# EAGLE design pro-one-oscillators-with-connectors-and-ground-plane (EAGLE 5.07)
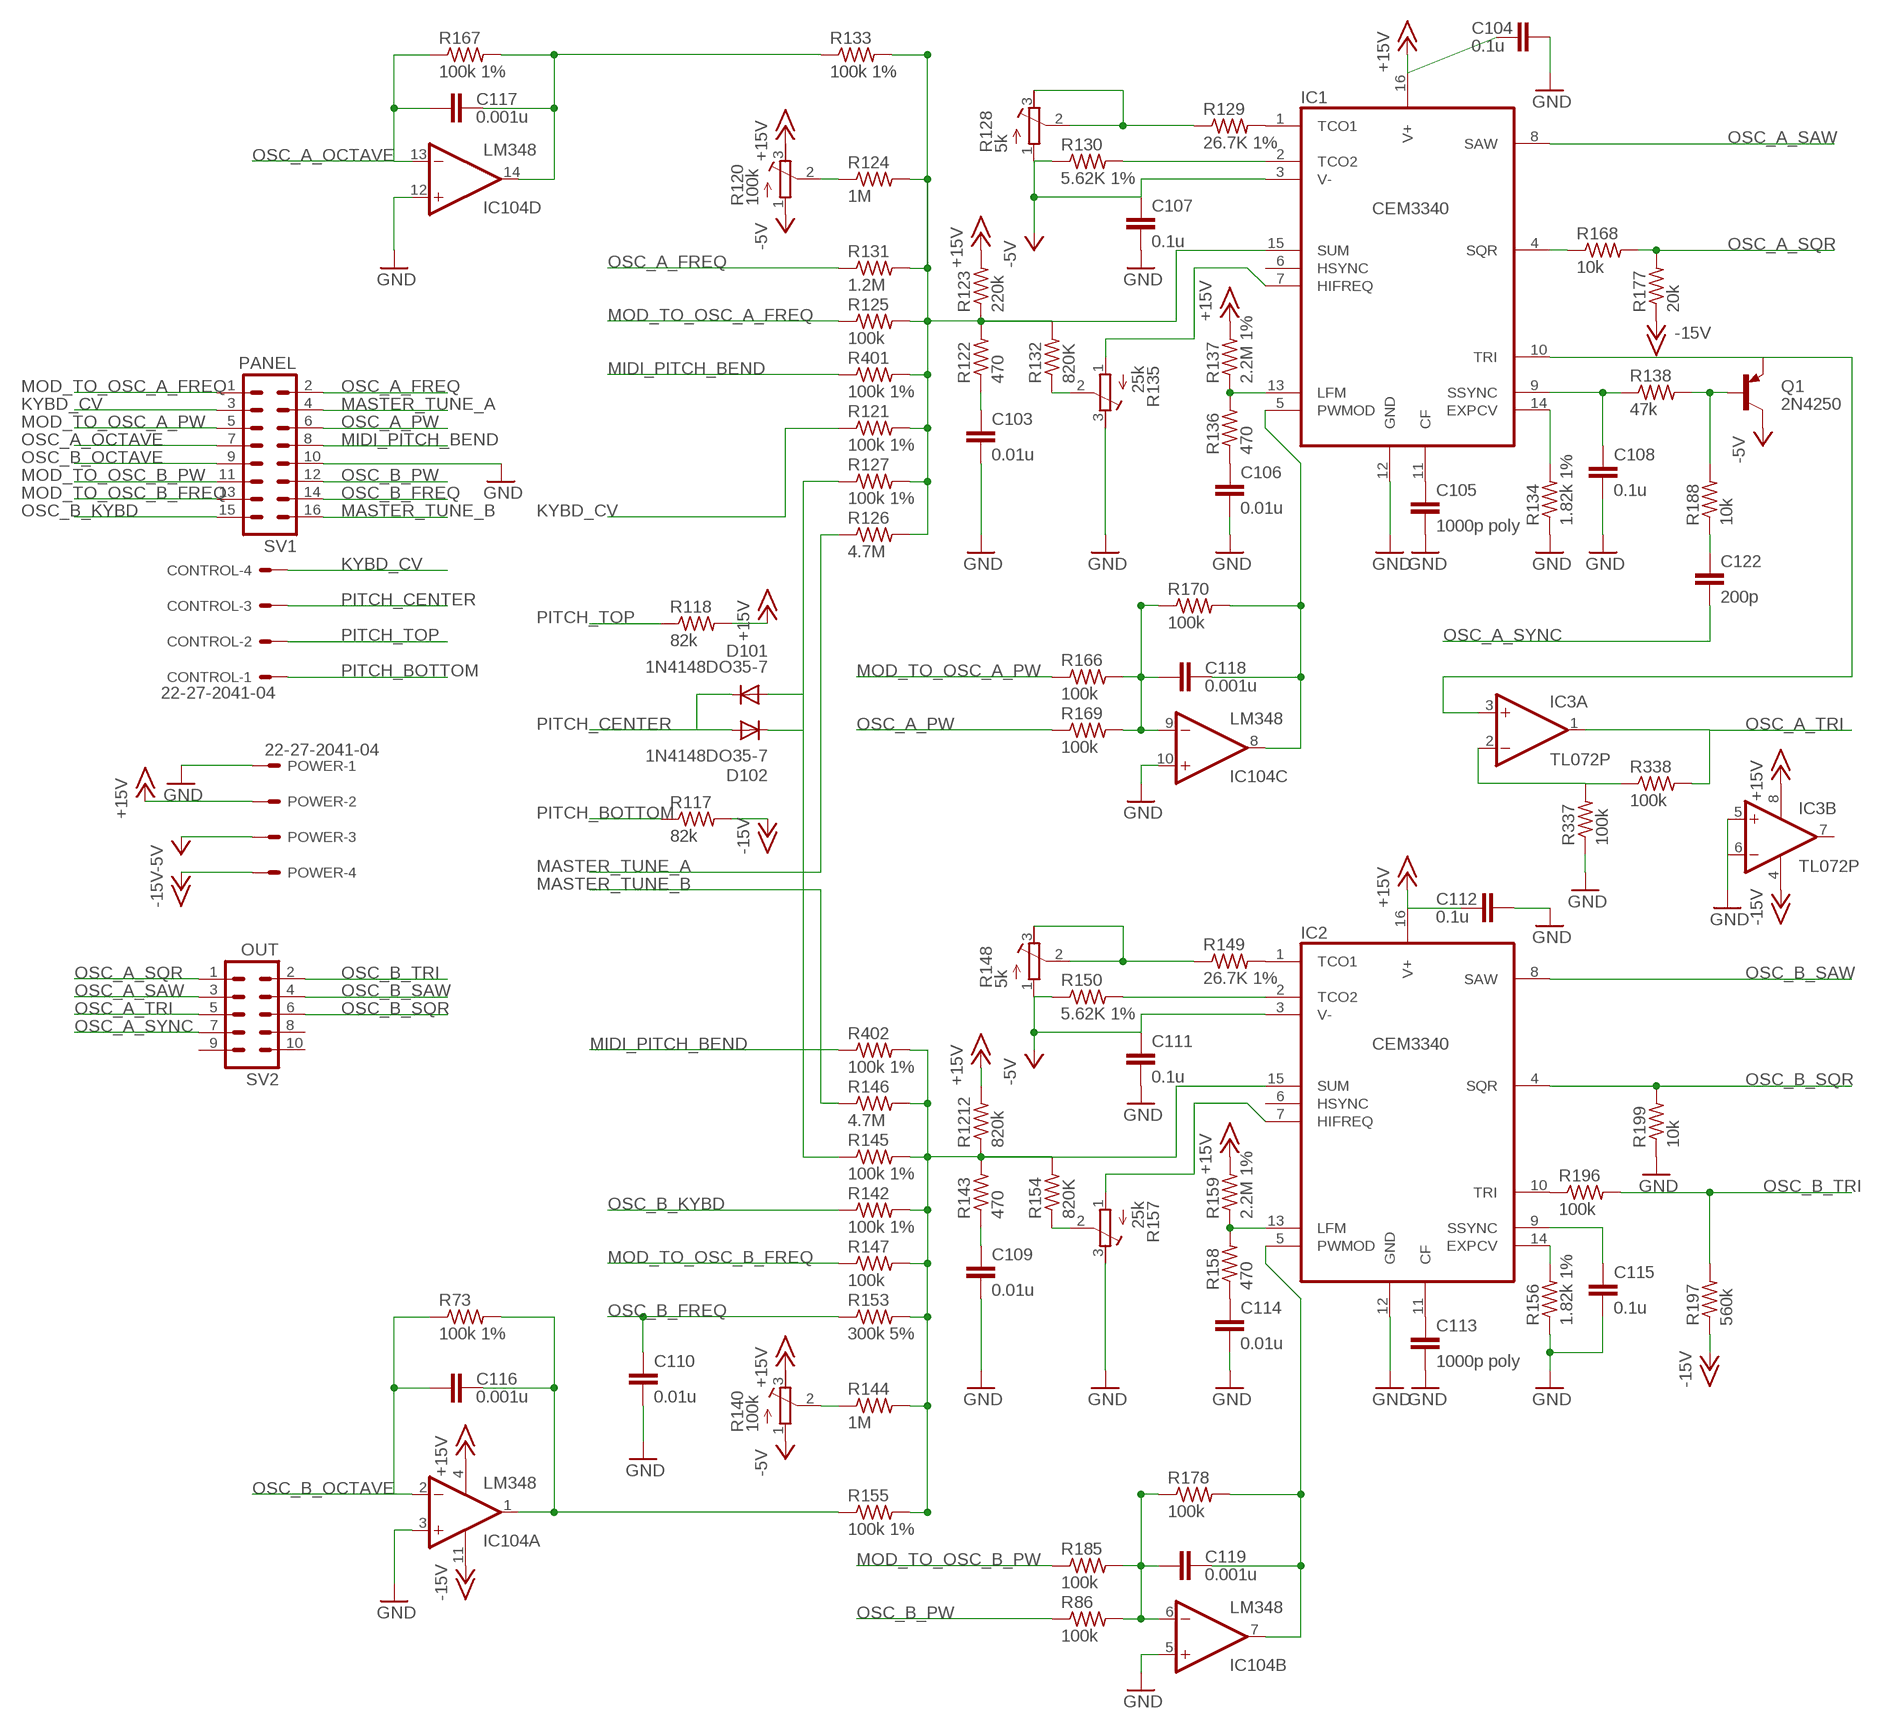
[diagram p0: schematic, sheet 1]

## Parts
C103  0.01u  C-EU050-025X075  [C050-025X075]
C104  0.1u  C-EU050-025X075  [C050-025X075]
C105  1000p poly  C-EU050-025X075  [C050-025X075]
C106  0.01u  C-EU050-025X075  [C050-025X075]
C107  0.1u  C-EU050-025X075  [C050-025X075]
C108  0.1u  C-EU050-025X075  [C050-025X075]
C109  0.01u  C-EU050-025X075  [C050-025X075]
C110  0.01u  C-EU050-025X075  [C050-025X075]
C111  0.1u  C-EU050-025X075  [C050-025X075]
C112  0.1u  C-EU050-025X075  [C050-025X075]
C113  1000p poly  C-EU050-025X075  [C050-025X075]
C114  0.01u  C-EU050-025X075  [C050-025X075]
C115  0.1u  C-EU050-025X075  [C050-025X075]
C116  0.001u  C-EU050-025X075  [C050-025X075]
C117  0.001u  C-EU050-025X075  [C050-025X075]
C118  0.001u  C-EU050-025X075  [C050-025X075]
C119  0.001u  C-EU050-025X075  [C050-025X075]
C122  200p  C-EU050-025X075  [C050-025X075]
CONTROL  22-27-2041-04  [6410-04]
D101  1N4148DO35-7  [DO35-7]
D102  1N4148DO35-7  [DO35-7]
IC1  CEM3340  [DIL16]
IC2  CEM3340  [DIL16]
IC3  TL072P  [DIL08]
IC104  LM348  [DIL14]
POWER  22-27-2041-04  [6410-04]
Q1  2N4250  [TO92]
R73  100k 1%  R-US_0309/10  [0309/10]
R86  100k  R-US_0309/10  [0309/10]
R117  82k  R-US_0309/10  [0309/10]
R118  82k  R-US_0309/10  [0309/10]
R120  100k  R-TRIMM64W  [RTRIM64W]
R121  100k 1%  R-US_0309/10  [0309/10]
R122  470  R-US_0309/10  [0309/10]
R123  220k  R-US_0309/10  [0309/10]
R124  1M  R-US_0309/10  [0309/10]
R125  100k  R-US_0309/10  [0309/10]
R126  4.7M  R-US_0309/10  [0309/10]
R127  100k 1%  R-US_0309/10  [0309/10]
R128  5k  R-TRIMM64W  [RTRIM64W]
R129  26.7K 1%  R-US_0309/10  [0309/10]
R130  5.62K 1%  R-US_0309/10  [0309/10]
R131  1.2M  R-US_0309/10  [0309/10]
R132  820K  R-US_0309/10  [0309/10]
R133  100k 1%  R-US_0309/10  [0309/10]
R134  1.82k 1%  R-US_0309/10  [0309/10]
R135  25k  R-TRIMM64W  [RTRIM64W]
R136  470  R-US_0309/10  [0309/10]
R137  2.2M 1%  R-US_0309/10  [0309/10]
R138  47k  R-US_0309/10  [0309/10]
R140  100k  R-TRIMM64W  [RTRIM64W]
R142  100k 1%  R-US_0309/10  [0309/10]
R143  470  R-US_0309/10  [0309/10]
R144  1M  R-US_0309/10  [0309/10]
R145  100k 1%  R-US_0309/10  [0309/10]
R146  4.7M  R-US_0309/10  [0309/10]
R147  100k  R-US_0309/10  [0309/10]
R148  5k  R-TRIMM64W  [RTRIM64W]
R149  26.7K 1%  R-US_0309/10  [0309/10]
R150  5.62K 1%  R-US_0309/10  [0309/10]
R153  300k 5%  R-US_0309/10  [0309/10]
R154  820K  R-US_0309/10  [0309/10]
R155  100k 1%  R-US_0309/10  [0309/10]
R156  1.82k 1%  R-US_0309/10  [0309/10]
R157  25k  R-TRIMM64W  [RTRIM64W]
R158  470  R-US_0309/10  [0309/10]
R159  2.2M 1%  R-US_0309/10  [0309/10]
R166  100k  R-US_0309/10  [0309/10]
R167  100k 1%  R-US_0309/10  [0309/10]
R168  10k  R-US_0309/10  [0309/10]
R169  100k  R-US_0309/10  [0309/10]
R170  100k  R-US_0309/10  [0309/10]
R177  20k  R-US_0309/10  [0309/10]
R178  100k  R-US_0309/10  [0309/10]
R185  100k  R-US_0309/10  [0309/10]
R188  10k  R-US_0309/10  [0309/10]
R196  100k  R-US_0309/10  [0309/10]
R197  560k  R-US_0309/10  [0309/10]
R199  10k  R-US_0309/10  [0309/10]
R337  100k  R-US_0309/10  [0309/10]
R338  100k  R-US_0309/10  [0309/10]
R401  100k 1%  R-US_0309/10  [0309/10]
R402  100k 1%  R-US_0309/10  [0309/10]
R1212  820k  R-US_0309/10  [0309/10]
SV1  PANEL  MA08-2  [MA08-2]
SV2  OUT  MA05-2  [MA05-2]

## Nets
+15V: C104.1 C112.1 IC1.16(V+) IC2.16(V+) IC3.8(P:V+) IC104.4(P:V+) POWER.2 R118.2 R120.3(A) R123.2 R137.2 R140.3(A) R159.2 R1212.2
-5V: C107.1 C111.1 IC1.3(V-) IC2.3(V-) POWER.3 Q1.1(C) R120.1(E) R128.1(E) R130.1 R140.1(E) R148.1(E) R150.1
-15V: IC3.4(P:V-) IC104.11(P:V-) POWER.4 R117.2 R177.1 R197.1
GND: C103.2 C104.2 C105.2 C106.2 C107.2 C108.2 C109.2 C110.2 C111.2 C112.2 C113.2 C114.2 C115.2 IC1.12(GND) IC2.12(GND) IC3.5(B:+IN) IC3.6(B:-IN) IC104.3(A:+IN) IC104.5(B:+IN) IC104.10(C:+IN) IC104.12(D:+IN) POWER.1 R134.1 R135.3(A) R156.1 R157.3(A) R199.1 R337.1 SV1.10
KYBD_CV: CONTROL.4 R121.1 SV1.3
MASTER_TUNE_A: R126.1 SV1.4
MASTER_TUNE_B: R146.1 SV1.16
MIDI_PITCH_BEND: R401.1 R402.1 SV1.8
MOD_TO_OSC_A_FREQ: R125.1 SV1.1
MOD_TO_OSC_A_PW: R166.1 SV1.5
MOD_TO_OSC_B_FREQ: R147.1 SV1.13
MOD_TO_OSC_B_PW: R185.1 SV1.11
N$1: IC1.1(TCO1) R129.2
N$2: IC1.2(TCO2) R130.2
N$3: IC1.13(LFM) R136.2 R137.1
N$4: IC1.15(SUM) R121.2 R122.2 R123.1 R124.2 R125.2 R126.2 R127.2 R131.2 R132.2 R133.2 R401.2
N$5: R128.2(S) R128.3(A) R129.1
N$6: C106.1 R136.1
N$7: C108.1 IC1.9(SSYNC) R138.1
N$8: IC1.7(HIFREQ) R135.1(E)
N$9: R132.1 R135.2(S)
N$10: C103.1 R122.1
N$11: C105.1 IC1.11(CF)
N$12: IC1.14(EXPCV) R134.2
N$13: IC1.4(SQR) R168.1
N$15: IC2.1(TCO1) R149.2
N$16: IC2.2(TCO2) R150.2
N$17: IC2.13(LFM) R158.2 R159.1
N$19: R148.2(S) R148.3(A) R149.1
N$20: IC2.7(HIFREQ) R157.1(E)
N$21: R154.1 R157.2(S)
N$22: C114.1 R158.1
N$23: C109.1 R143.1
N$24: IC2.14(EXPCV) R156.2
N$27: C115.1 IC2.9(SSYNC)
N$28: C113.1 IC2.11(CF)
N$30: R140.2(S) R144.1
N$31: D101.A D102.C R127.1 R145.1
N$34: C118.2 IC1.5(PWMOD) IC104.8(C:OUT) R170.2
N$36: C118.1 IC104.9(C:-IN) R166.2 R169.2 R170.1
N$38: C119.1 IC104.6(B:-IN) R86.2 R178.1 R185.2
N$39: C119.2 IC2.5(PWMOD) IC104.7(B:OUT) R178.2
N$40: C116.2 IC104.1(A:OUT) R73.2 R155.1
N$41: IC2.15(SUM) R142.2 R143.2 R144.2 R145.2 R146.2 R147.2 R153.2 R154.2 R155.2 R402.2 R1212.1
N$43: R120.2(S) R124.1
N$44: IC3.2(A:-IN) R337.2 R338.1
N$46: C117.2 IC104.14(D:OUT) R133.1 R167.2
N$52: Q1.2(B) R138.2 R188.2
N$54: IC1.10(TRI) IC3.3(A:+IN) Q1.3(E)
N$61: C122.1 R188.1
N$64: IC2.10(TRI) R196.1
OSC_A_FREQ: R131.1 SV1.2
OSC_A_OCTAVE: C117.1 IC104.13(D:-IN) R167.1 SV1.7
OSC_A_PW: R169.1 SV1.6
OSC_A_SAW: IC1.8(SAW) SV2.3
OSC_A_SQR: R168.2 R177.2 SV2.1
OSC_A_SYNC: C122.2 SV2.7
OSC_A_TRI: IC3.1(A:OUT) R338.2 SV2.5
OSC_B_FREQ: C110.1 R153.1 SV1.14
OSC_B_KYBD: R142.1 SV1.15
OSC_B_OCTAVE: C116.1 IC104.2(A:-IN) R73.1 SV1.9
OSC_B_PW: R86.1 SV1.12
OSC_B_SAW: IC2.8(SAW) SV2.4
OSC_B_SQR: IC2.4(SQR) R199.2 SV2.6
OSC_B_TRI: R196.2 R197.2 SV2.2
PITCH_BOTTOM: CONTROL.1 R117.1
PITCH_CENTER: CONTROL.3 D101.C D102.A
PITCH_TOP: CONTROL.2 R118.1
Unconnected: IC1.6(HSYNC) IC2.6(HSYNC) IC3.7(B:OUT) SV2.8 SV2.9 SV2.10

## Library data of the parts
C103-C119 C122 = resistor:C-EU: CAPACITOR, European symbol
CONTROL POWER = con-molex:22-?-04: CONNECTOR wire to board 2.54 mm (.1 inch) pitch header
D101 D102 = diode:1N4148: DIODE high speed (Philips)
IC1 IC2 = joakim:CEM3340: Voltage Controlled Oscillator for musical synthesizers
IC3 = linear:TL072: OP AMP
IC104 = joakim:LM348: Quad General Purpose, Low Voltage, Operational Amplifiers
Q1 = joakim:2N4250: PNP Transistor
R73 R86 R117 R118 R121-R127 R129-R134 R136-R138 R142-R147 R149 R150 R153-R156 R158 R159 R166-R170 R177 R178 R185 R188 R196 R197 R199 R337 R338 R401 R402 R1212 = resistor:R-US_: RESISTOR, American symbol
R120 R128 R135 R140 R148 R157 = resistor:R-TRIMM: Trimm resistor
SV1 = con-lstb:MA08-2: PIN HEADER
SV2 = con-lstb:MA05-2: PIN HEADER

## Board
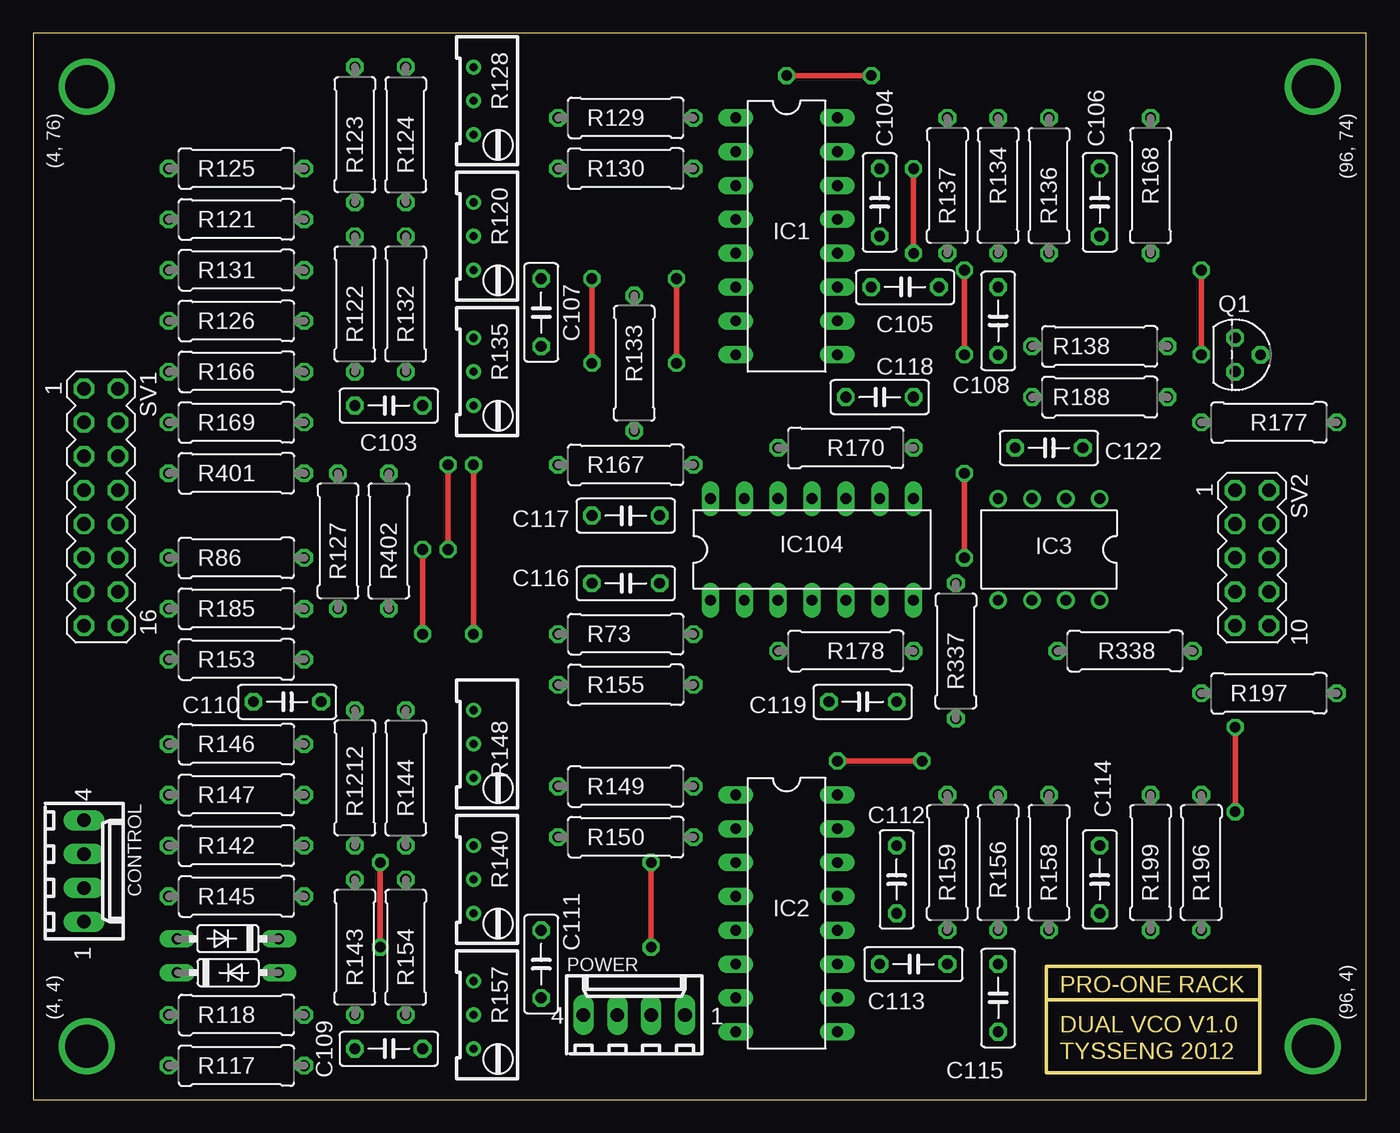
[diagram p1: board, top side]
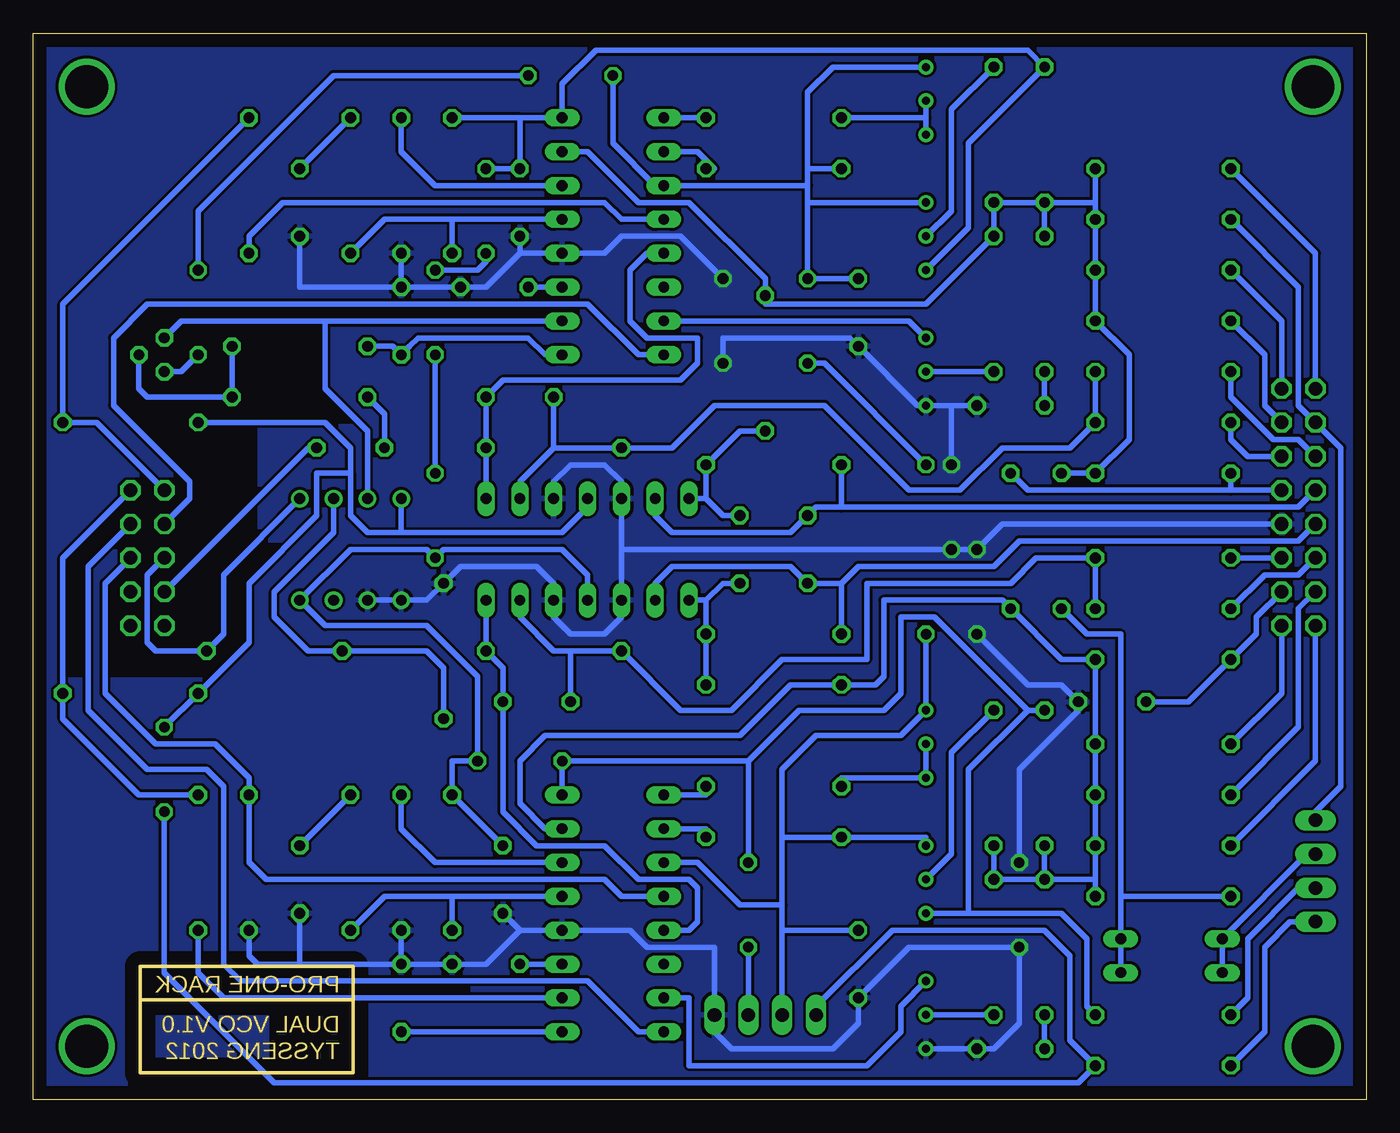
[diagram p2: board, bottom side, seen from below]

Size 100 x 80 mm. Coordinates in mm from the lower left corner, seen from the top.
Outline: 76,7.5 76,10 92,10 92,7.5
Outline: 76,7.5 76,2 92,2 92,7.5
Outline: 92,7.5 76,7.5
Outline: 0,0 100,0 100,80 0,80 0,0
Copper layers (1*16): Top 0.035mm / dielectric 1.5mm / Bottom 0.035mm
Design rules "default": minimum track width 10mil, minimum drill 24mil, track to track 8mil, track to pad 8mil, pad to pad 8mil, via to via 8mil, smd to smd 8mil, copper to edge 40mil, drill to drill 8mil, minimum pad ring 10mil, minimum via ring 8mil, stop-mask expansion 4mil, vias tented up to drill 0mil, thermal gap 10mil

### Footprints (pad centres in the part's own frame; a part is rotated, then mirrored left to right if it is on the bottom)
C050-025X075 = drill 0.813 octagon: 1 -2.54,0; 2 2.54,0
6410-04 = drill 1.016 long: 1 3.81,0; 2 1.27,0; 3 -1.27,0; 4 -3.81,0
DO35-7 = drill 0.813 long: A 3.81,0; C -3.81,0
DIL16 = drill 0.813 long: 1 -8.89,-3.81; 2 -6.35,-3.81; 3 -3.81,-3.81; 4 -1.27,-3.81; 5 1.27,-3.81; 6 3.81,-3.81; 7 6.35,-3.81; 8 8.89,-3.81; 9 8.89,3.81; 10 6.35,3.81; 11 3.81,3.81; 12 1.27,3.81; 13 -1.27,3.81; 14 -3.81,3.81; 15 -6.35,3.81; 16 -8.89,3.81
DIL08 = drill 0.813 pad 1.27 round: 1 -3.81,-3.81; 2 -1.27,-3.81; 3 1.27,-3.81; 4 3.81,-3.81; 5 3.81,3.81; 6 1.27,3.81; 7 -1.27,3.81; 8 -3.81,3.81
DIL14 = drill 0.813 long: 1 -7.62,-3.81; 2 -5.08,-3.81; 3 -2.54,-3.81; 4 0,-3.81; 5 2.54,-3.81; 6 5.08,-3.81; 7 7.62,-3.81; 8 7.62,3.81; 9 5.08,3.81; 10 2.54,3.81; 11 0,3.81; 12 -2.54,3.81; 13 -5.08,3.81; 14 -7.62,3.81
TO92 = drill 0.813 octagon: 1 1.27,0; 2 0,1.905; 3 -1.27,0
0309/10 = drill 0.813 octagon: 1 -5.08,0; 2 5.08,0
RTRIM64W = drill 0.61 round: 1 1.27,-2.54; 2 1.27,0; 3 1.27,2.54
MA08-2 = drill 1.016 octagon: 1 -8.89,-1.27; 2 -8.89,1.27; 3 -6.35,-1.27; 4 -6.35,1.27; 5 -3.81,-1.27; 6 -3.81,1.27; 7 -1.27,-1.27; 8 -1.27,1.27; 9 1.27,-1.27; 10 1.27,1.27; 11 3.81,-1.27; 12 3.81,1.27; 13 6.35,-1.27; 14 6.35,1.27; 15 8.89,-1.27; 16 8.89,1.27
MA05-2 = drill 1.016 octagon: 1 -5.08,-1.27; 2 -5.08,1.27; 3 -2.54,-1.27; 4 -2.54,1.27; 5 0,-1.27; 6 0,1.27; 7 2.54,-1.27; 8 2.54,1.27; 9 5.08,-1.27; 10 5.08,1.27

### Placement (x,y rotation side)
C103  26.67,52.07 0 top
C104  63.5,67.31 270 top
C105  65.41,60.96 0 top
C106  80.01,67.31 270 top
C107  38.1,59.05 270 top
C108  72.39,58.42 90 top
C109  26.67,3.81 0 top
C110  19.05,29.84 0 top
C111  38.1,10.16 270 top
C112  64.77,16.51 270 top
C113  66.04,10.16 0 top
C114  80.01,16.51 270 top
C115  72.39,7.62 90 top
C116  44.45,38.73 0 top
C117  44.45,43.81 0 top
C118  63.5,52.7 0 top
C119  62.23,29.84 0 top
C122  76.2,48.9 0 top
CONTROL  3.81,17.14 270 top
D101  14.61,9.53 0 top
D102  14.61,12.06 180 top
IC1  56.52,64.77 270 top
IC2  56.52,13.97 270 top
IC3  76.2,41.27 180 top
IC104  58.42,41.27 0 top
POWER  45.09,6.35 0 top
Q1  90.17,55.88 270 top
R73  44.45,34.92 0 top
R86  15.24,40.64 0 top
R117  15.24,2.54 0 top
R118  15.24,6.35 0 top
R120  34.29,64.77 180 top
R121  15.24,66.04 0 top
R122  24.13,59.69 90 top
R123  24.13,72.39 90 top
R124  27.94,72.39 270 top
R125  15.24,69.85 0 top
R126  15.24,58.42 0 top
R127  22.86,41.91 90 top
R128  34.29,74.93 180 top
R129  44.45,73.66 0 top
R130  44.45,69.85 0 top
R131  15.24,62.23 0 top
R132  27.94,59.69 90 top
R133  45.09,55.24 90 top
R134  72.39,68.58 90 top
R135  34.29,54.61 180 top
R136  76.2,68.58 270 top
R137  68.58,68.58 90 top
R138  80.01,56.52 0 top
R140  34.29,16.51 180 top
R142  15.24,19.05 0 top
R143  24.13,11.43 90 top
R144  27.94,24.13 270 top
R145  15.24,15.24 0 top
R146  15.24,26.67 0 top
R147  15.24,22.86 0 top
R148  34.29,26.67 180 top
R149  44.45,23.5 0 top
R150  44.45,19.68 0 top
R153  15.24,33.02 0 top
R154  27.94,11.43 90 top
R155  44.45,31.11 180 top
R156  72.39,17.78 90 top
R157  34.29,6.35 180 top
R158  76.2,17.78 270 top
R159  68.58,17.78 90 top
R166  15.24,54.61 0 top
R167  44.45,47.62 0 top
R168  83.82,68.58 90 top
R169  15.24,50.8 0 top
R170  60.96,48.9 0 top
R177  92.71,50.8 0 top
R178  60.96,33.66 0 top
R185  15.24,36.83 0 top
R188  80.01,52.7 0 top
R196  87.63,17.78 90 top
R197  92.71,30.48 0 top
R199  83.82,17.78 90 top
R337  69.22,33.66 270 top
R338  81.92,33.66 0 top
R401  15.24,46.99 0 top
R402  26.67,41.91 270 top
R1212  24.13,24.13 90 top
SV1  5.08,44.45 270 top
SV2  91.44,40.64 270 top

### Tracks (layer width: path | path; a pad name or v marks a point on that pad's centre or on a via)
+15V  (via drill 0.8 pad 1.27)
  Top 0.406: v69.85,40.64 v69.85,46.99 | v69.85,55.88 v69.85,62.23 | v66.04,63.5 v66.04,69.85 | v46.35,17.78 v46.35,11.43 | v60.33,25.4 v66.67,25.4
  Bottom 0.406: 25.4,29.21 29.84,24.77 29.84,13.97 | R120.3 29.84,65.41 29.84,71.75 R123.2 25.4,78.74 57.78,78.74 60.33,76.2 IC1.16 63.5,73.66 | 63.5,73.66 R137.2 | R118.2 20.95,6.99 20.95,12.06 22.86,13.97 29.84,13.97 | 29.84,13.97 R140.3 | IC104.4 58.42,39.37 60.33,41.27 69.22,41.27 v69.85,40.64 70.48,41.27 76.2,41.27 IC3.8 78.11,35.56 70.48,35.56 66.67,31.75 v66.67,25.4 68.58,25.4 R159.2 C112.1 | 63.5,73.66 C104.1 v66.04,69.85 | v69.85,46.99 v69.85,55.88 | v69.85,62.23 66.67,62.23 66.04,62.87 v66.04,63.5 | IC2.16 v60.33,25.4 46.35,25.4 | 46.35,25.4 42.55,29.21 36.2,29.21 34.92,30.48 34.92,36.2 32.38,36.2 25.4,29.21 | 25.4,29.21 R1212.2 | 46.35,25.4 v46.35,17.78 | v46.35,11.43 POWER.2
-5V  (via drill 0.8 pad 1.27)
  Top 0.406: v41.91,55.24 v41.91,61.59 | v87.63,62.23 v87.63,55.88 | v56.52,76.83 v62.87,76.83 | v33.02,34.92 v33.02,47.62
  Bottom 0.406: R128.1 40.01,77.47 41.91,75.56 41.91,69.85 | R140.1 33.02,19.68 R150.1 43.81,19.68 | IC2.3 50.16,17.78 46.99,14.61 43.81,14.61 | v41.91,55.24 40.64,55.24 v33.02,47.62 | C107.1 v41.91,61.59 41.91,67.31 | 41.91,67.31 R120.1 | 41.91,68.58 IC1.3 53.34,68.58 56.52,71.75 v56.52,76.83 | 43.81,14.61 43.81,19.68 | 43.81,19.68 43.81,24.77 41.27,27.3 34.92,27.3 R148.1 v33.02,34.92 | 41.91,68.58 41.91,69.85 | 41.91,67.31 41.91,68.58 | 41.91,69.85 R130.1 | POWER.3 43.81,12.7 | 43.81,12.7 43.81,14.61 | v87.63,55.88 88.9,54.61 Q1.1 | v87.63,62.23 87.63,66.67 77.47,76.83 v62.87,76.83 | 43.81,12.7 C111.1
-15V  (via drill 0.8 pad 1.27)
  Top 0.406: v90.17,21.59 v90.17,27.94
  Bottom 0.406: IC104.11 58.42,44.45 60.33,42.55 72.39,42.55 | 72.39,42.55 IC3.4 | 76.2,46.99 78.74,46.99 78.74,43.81 83.82,38.73 83.82,34.29 R197.1 v90.17,27.94 | 76.2,46.99 76.2,43.81 74.93,42.55 72.39,42.55 | POWER.4 41.27,6.99 35.56,12.7 24.13,12.7 22.23,10.79 22.23,4.45 R117.2 21.59,1.27 81.92,1.27 90.17,9.53 v90.17,21.59 | R177.1 78.11,50.8 76.2,48.9 76.2,46.99
GND  (via drill 0.8 pad 1.27)
  Top 0.406: v48.26,55.24 v48.26,61.59 | v26.04,11.43 v26.04,17.78 | v29.21,34.92 v29.21,41.27 | v31.11,41.27 v31.11,47.62
  Bottom 0.406: C115.2 C113.2 66.04,10.16 63.5,12.7 | C115.2 R156.1 | C115.2 80.01,10.16 | 80.01,10.16 C114.2 | R199.1 83.82,10.79 83.19,10.16 80.01,10.16 | 63.5,63.5 IC1.12 57.15,63.5 55.88,64.77 51.44,64.77 v48.26,61.59 | 63.5,63.5 66.04,60.96 C105.2 C108.2 | C108.2 R134.1 | C108.2 80.01,60.96 C106.2 | IC3.6 IC3.5 70.48,37.47 R337.1 67.94,40.01 62.23,40.01 60.96,38.73 IC104.5 60.96,36.2 59.69,34.92 57.15,34.92 55.88,36.2 IC104.3 55.88,41.27 | IC104.10 60.96,46.35 59.69,47.62 57.15,47.62 55.88,46.35 IC104.12 55.88,41.27 | 63.5,12.7 IC2.12 55.24,12.7 53.98,11.43 48.9,11.43 POWER.1 48.9,5.08 47.62,3.81 40.01,3.81 38.1,5.71 C111.2 34.29,11.43 v26.04,11.43 26.04,5.71 27.94,3.81 R157.3 C109.2 | 63.5,63.5 C104.2 | v48.26,55.24 48.26,57.15 38.73,57.15 C107.2 33.66,52.07 R135.3 31.11,52.07 | 63.5,12.7 C112.2 | 31.11,52.07 C103.2 | SV1.10 27.3,43.18 v29.21,41.27 v31.11,41.27 55.88,41.27 | v26.04,17.78 26.04,24.77 21.59,29.21 C110.2 22.86,31.11 25.4,31.11 v29.21,34.92 | v31.11,47.62 31.11,52.07
  pour Bottom: 0.5,79.5 99.5,79.5 99.5,0.5 0.5,0.5
KYBD_CV
  Bottom 0.406: R121.1 5.08,60.96 5.08,52.07 SV1.3 1.91,48.9 1.91,23.5 3.81,21.59 CONTROL.4
MASTER_TUNE_A
  Bottom 0.406: SV1.4 7.62,52.07 7.62,55.88 R126.1
MASTER_TUNE_B
  Bottom 0.406: SV1.16 6.35,30.48 R146.1
MIDI_PITCH_BEND
  Bottom 0.406: SV1.8 10.16,45.72 | 10.16,45.72 25.4,45.72 R402.1 | 10.16,45.72 R401.1
MOD_TO_OSC_A_FREQ
  Bottom 0.406: SV1.1 3.81,63.5 R125.1
MOD_TO_OSC_A_PW
  Bottom 0.406: SV1.5 5.08,49.53 6.99,49.53 10.16,52.7 R166.1
MOD_TO_OSC_B_FREQ
  Bottom 0.406: SV1.13 5.08,36.83 5.08,27.94 R147.1
MOD_TO_OSC_B_PW
  Bottom 0.406: SV1.11 5.08,39.37 7.62,39.37 R185.1
N$1
  Bottom 0.406: R129.2 IC1.1
N$2
  Bottom 0.406: R130.2 48.9,69.85 50.16,71.12 IC1.2
N$3
  Bottom 0.406: IC1.13 68.58,66.04 | 68.58,66.04 73.66,66.04 R136.2 | 68.58,66.04 R137.1
N$4
  Bottom 0.406: 20.32,67.31 R121.2 R131.2 R126.2 17.78,55.88 17.78,49.53 R401.2 R127.2 | 20.32,67.31 R125.2 | R123.1 R122.2 | R123.1 R124.2 R132.2 33.02,59.69 45.09,59.69 R133.2 45.09,61.59 50.8,67.31 54.61,67.31 58.42,71.12 IC1.15 | 20.32,67.31 R123.1
N$5
  Bottom 0.406: R128.3 33.02,73.66 | 33.02,73.66 R128.2 | 33.02,73.66 R129.1
N$6
  Bottom 0.406: C106.1 R136.1
N$7
  Bottom 0.406: IC1.9 61.59,55.88 62.87,57.15 71.12,57.15 71.75,56.52 C108.1 73.03,56.52 R138.1
N$8
  Bottom 0.406: R135.1 34.29,58.42 IC1.7
N$9
  Bottom 0.406: R132.1 R135.2
N$10
  Bottom 0.406: C103.1 R122.1
N$11
  Bottom 0.406: IC1.11 C105.1
N$12
  Bottom 0.406: IC1.14 69.85,68.58 72.39,71.12 R134.2
N$13
  Bottom 0.406: R168.1 83.82,64.77 81.28,67.31 57.15,67.31 55.88,66.04 IC1.4
N$14  (via drill 3.2)
  other vias: 4,76
N$15
  Bottom 0.406: R149.2 49.53,22.86 IC2.1
N$16
  Bottom 0.406: R150.2 49.53,20.32 IC2.2
N$17
  Bottom 0.406: IC2.13 68.58,15.24 | 68.58,15.24 73.66,15.24 R158.2 | 68.58,15.24 R159.1
N$18  (via drill 3.2)
  other vias: 96,76
N$19
  Bottom 0.406: R149.1 39.37,24.13 R148.3 R148.2
N$20
  Bottom 0.406: R157.1 34.92,6.99 34.92,5.08 37.47,2.54 50.8,2.54 50.8,7.62 IC2.7
N$21
  Bottom 0.406: R154.1 R157.2
N$22
  Bottom 0.406: C114.1 R158.1
N$23
  Bottom 0.406: C109.1 R143.1
N$24
  Bottom 0.406: IC2.14 69.85,17.78 72.39,20.32 R156.2
N$25  (via drill 3.2)
  other vias: 96,4
N$26  (via drill 3.2)
  other vias: 4,4
N$27
  Bottom 0.406: IC2.9 C115.1
N$28
  Bottom 0.406: IC2.11 C113.1
N$30
  Bottom 0.406: R144.1 31.11,26.04 31.11,18.41 R140.2
N$31
  Bottom 0.406: D101.A D102.C 18.41,15.24 | 18.41,15.24 18.41,34.92 20.95,34.92 R127.1 | 18.41,15.24 R145.1
N$32
  pour Bottom: 83,1 99.5,1 99.5,31.5 82.5,31.5 82.5,1
N$33
  pour Bottom: 31,79.5 67.5,79.5 67.5,63.5 30.5,63.5 30.5,79.5
N$34
  Bottom 0.406: IC104.8 R170.2 C118.2 64.77,53.98 51.44,53.98 50.16,55.24 50.16,57.15 53.98,57.15 55.24,58.42 55.24,62.23 53.98,63.5 IC1.5
N$35
  pour Bottom: 1.5,55.5 1.5,34.5 16,34.5 16,55.5
N$36
  Bottom 0.406: R166.2 R169.2 22.23,48.9 27.3,48.9 30.48,45.72 34.29,45.72 40.64,52.07 48.9,52.07 52.07,48.9 R170.1 60.96,48.9 | IC104.9 63.5,46.35 60.96,48.9 | 60.96,48.9 C118.1
N$37
  pour Bottom: 50.5,21 50.5,11 51,11 51,6.5 67,6.5 67,21
N$38
  Bottom 0.406: 59.69,33.66 R178.1 51.44,29.21 47.62,29.21 43.81,33.02 37.47,33.02 37.47,38.73 26.67,38.73 24.77,40.64 R86.2 R185.2 | 59.69,33.66 C119.1 | IC104.6 63.5,36.2 60.96,33.66 59.69,33.66
N$39
  Bottom 0.406: IC104.7 R178.2 64.77,32.38 C119.2 64.77,21.59 62.23,19.05 57.15,19.05 54.61,16.51 50.8,16.51 50.16,15.88 50.16,13.34 50.8,12.7 IC2.5
N$40
  Bottom 0.406: R155.1 R73.2 49.53,37.47 | 49.53,37.47 48.26,38.73 C116.2 | 49.53,37.47 IC104.1
N$41
  Bottom 0.406: R145.2 20.32,16.51 | 20.32,16.51 R142.2 R147.2 R146.2 R153.2 22.86,33.02 R402.2 27.3,37.47 36.2,37.47 36.2,31.75 36.83,31.11 R155.2 43.18,31.11 46.99,27.3 61.59,27.3 63.5,25.4 63.5,22.23 61.59,20.32 IC2.15 | R143.2 R1212.1 | R143.2 R154.2 R144.2 | 20.32,16.51 R143.2
N$42
  pour Bottom: 4,23.5 4,8.5 4.5,8.5 14,8.5 14,23.5
N$43
  Bottom 0.406: R124.1 31.11,74.3 31.11,66.67 R120.2
N$44
  Bottom 0.406: IC3.2 77.47,42.55 81.92,38.1 81.92,36.2 79.38,33.66 R338.1 70.48,33.66 69.22,32.38 R337.2
N$45
  pour Bottom: 72,50.5 72,42 83,42 83,50.5
N$46
  Bottom 0.406: R133.1 46.99,50.16 R167.2 49.53,45.09 | C117.2 48.26,43.81 49.53,45.09 | 49.53,45.09 IC104.14
N$52
  Bottom 0.406: 85.09,55.88 R138.2 R188.2 91.44,52.7 92.08,53.34 Q1.2
N$54
  Bottom 0.406: IC3.3 74.93,50.16 78.11,53.34 78.11,58.42 | 78.11,58.42 88.9,58.42 Q1.3 | 78.11,58.42 IC1.10
N$61
  Bottom 0.406: C122.1 73.66,51.44 R188.1
N$64
  Bottom 0.406: R196.1 87.63,9.53 85.72,7.62 IC2.10
OSC_A_FREQ
  Bottom 0.406: SV1.2 6.35,58.42 R131.1
OSC_A_OCTAVE
  Bottom 0.406: SV1.7 5.08,44.45 39.37,44.45 | 39.37,44.45 R167.1 | 39.37,44.45 41.27,44.45 C117.1 43.18,42.55 52.07,42.55 53.34,43.81 IC104.13
OSC_A_PW
  Bottom 0.406: SV1.6 8.89,48.26 10.16,49.53 R169.1
OSC_A_SAW
  Bottom 0.406: IC1.8 54.61,55.88 58.42,59.69 91.44,59.69 93.98,57.15 93.98,52.07 88.27,46.35 88.27,45.09 SV2.3
OSC_A_SQR
  Bottom 0.406: SV2.1 95.25,50.8 R177.2 97.79,59.69 R168.2
OSC_A_SYNC
  Bottom 0.406: SV2.7 79.38,48.9 C122.2
OSC_A_TRI
  Bottom 0.406: SV2.5 91.44,39.37 91.44,34.29 90.81,33.66 R338.2 85.72,34.92 85.72,39.37 IC3.1
OSC_B_FREQ
  Bottom 0.406: SV1.14 8.26,36.2 8.26,34.92 R153.1 13.34,29.84 C110.1
OSC_B_KYBD
  Bottom 0.406: SV1.15 3.81,25.4 R142.1
OSC_B_OCTAVE
  Bottom 0.406: 39.37,38.73 38.1,40.01 27.94,40.01 26.04,41.91 5.08,41.91 SV1.9 | 39.37,38.73 R73.1 | 39.37,38.73 C116.1 43.18,40.01 52.07,40.01 53.34,38.73 IC104.2
OSC_B_PW
  Bottom 0.406: SV1.12 R86.1
OSC_B_SAW
  Bottom 0.406: IC2.8 54.61,5.08 58.42,8.89 84.45,8.89 85.72,10.16 85.72,23.5 87,24.77 91.44,24.77 95.89,29.21 95.89,40.01 SV2.4
OSC_B_SQR
  Bottom 0.406: IC2.4 55.88,15.24 57.15,16.51 82.55,16.51 83.82,17.78 R199.2 83.82,24.13 86.36,26.67 90.81,26.67 94.61,30.48 94.61,38.73 SV2.6
OSC_B_TRI
  Bottom 0.406: SV2.2 97.79,40.64 R197.2 97.79,28.57 92.08,22.86 R196.2
PITCH_BOTTOM
  Bottom 0.406: CONTROL.1 5.71,13.34 7.62,11.43 7.62,5.08 R117.1
PITCH_CENTER
  Bottom 0.406: D101.C D102.A 4.45,18.41 CONTROL.3
PITCH_TOP
  Bottom 0.406: R118.1 8.89,7.62 8.89,12.06 5.08,15.88 CONTROL.2

### Text on the board
Dimension: PRO-ONE RACK | DUAL VCO V1.0 | TYSSENG 2012
tPlace: (4, 76) | (96, 74) | (4, 4) | (96, 4)